# Altium schematic sheet 5. Buck_5V1A.SchDoc
size A4; SheetNumber: 5; SheetTotal: 6
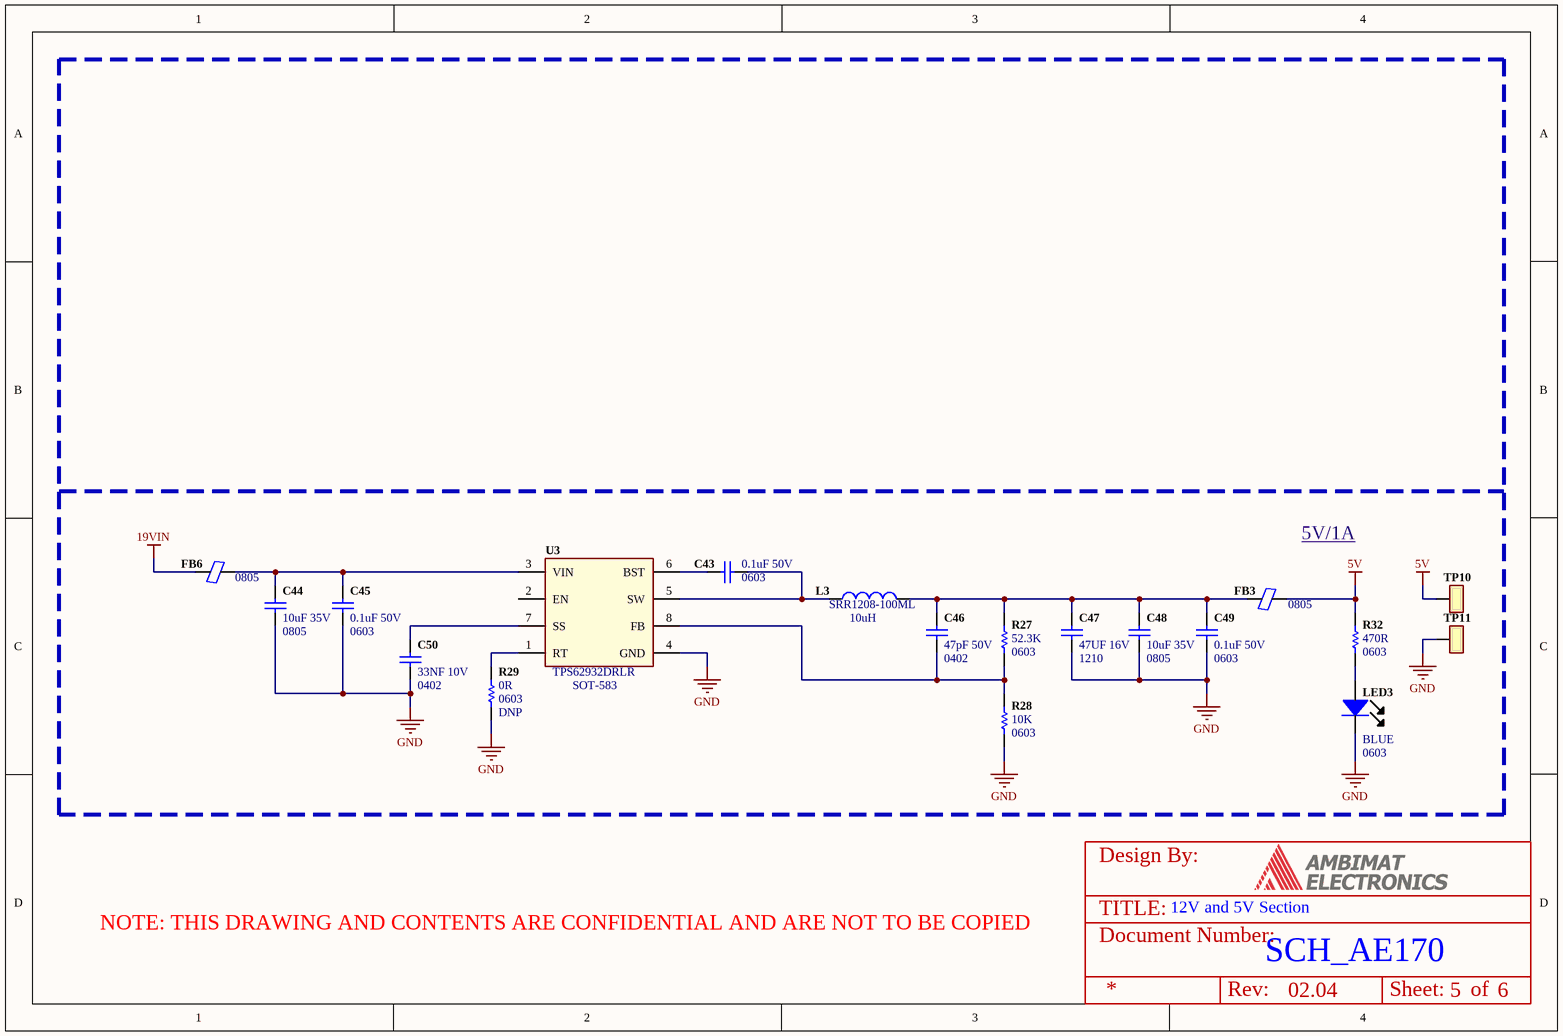
[diagram p0: 5. Buck_5V1A.SchDoc]

## Parts
C43  Part Name: 0.1uF 50V  PCB Footprint: 0603  [0603C]  (hidden comment: CAP CER 0.1UF 50V X7R 0603)
C44  Part Name: 10uF 35V  PCB Footprint: 0805  [0805C]  (hidden comment: CAP CER 10UF 35V X5R 0805)
C45  Part Name: 0.1uF 50V  PCB Footprint: 0603  [0603C]  (hidden comment: CAP CER 0.1UF 50V X7R 0603)
C46  Part Name: 47pF 50V  PCB Footprint: 0402  [0402C]  (hidden comment: CAP CER 47PF 50V C0G/NP0 0402)
C47  Part Name: 47UF 16V  PCB Footprint: 1210  [1210C]  (hidden comment: CAP CER 47UF 16V X5R 1210)
C48  Part Name: 10uF 35V  PCB Footprint: 0805  [0805C]  (hidden comment: CAP CER 10UF 35V X5R 0805)
C49  Part Name: 0.1uF 50V  PCB Footprint: 0603  [0603C]  (hidden comment: CAP CER 0.1UF 50V X7R 0603)
C50  Part Name: 33NF 10V  PCB Footprint: 0402  [0402C]  (hidden comment: CAP CER 0.033UF 10V X7R 0402)
FB3  PCB Footprint: 0805  [0805F]  (hidden comment: FERRITE BEAD 120 OHM 0805 1LN)
FB6  PCB Footprint: 0805  [0805F]  (hidden comment: FERRITE BEAD 120 OHM 0805 1LN)
L3  Manu Part Number: SRR1208-100ML  Part Name: 10uH  [IND_BOURNS_SRR1208]  (hidden comment: FIXED IND 10UH 5A 21 MOHM SMD)
LED3  PCB Footprint: 0603  Color: BLUE  [LED0603_BLUE]  (hidden comment: LB Q39G-L2N2-35-1)
R27  Part Name: 52.3K  [0603]  (hidden comment: RES 52.3K OHM 1% 1/10W 0603)
R28  Part Name: 10K  [0603]  (hidden comment: RES SMD 10K OHM 5% 1/10W 0603)
R29  Mounting: DNP  Part Name: 0R  [0603]  (hidden comment: RES SMD 0 OHM JUMPER 1/10W 0603)
R32  Part Name: 470R  [0603]  (hidden comment: RES 470 OHM 1/10W 5% 0603 SMD)
TP10  TEST POINT  [TP-1.5mmSMD]  (value not drawn)
TP11  TEST POINT  [TP-1.5mmSMD]  (value not drawn)
U3  PCB Footprint: SOT-583  Part Name: TPS62932DRLR  [SOT8_DRL_TEX]  (hidden comment: IC REG BUCK ADJ 2A SOT583)

## Blocks framed on the sheet
5V/1A: C43-C50 FB3 FB6 L3 LED3 R27-R29 R32 TP10 TP11 U3

## Nets
5V: FB3.2 R32.2 TP10.1
19VIN: FB6.1
GND: C44.2 C45.2 C47.1 C48.2 C49.2 C50.1 LED3.2(K) R28.1 R29.1 TP11.1 U3.4(GND)
NetC43_1: C43.1 U3.6(BST)
NetC43_2: C43.2 L3.1 U3.5(SW)
NetC44_1: C44.1 C45.1 FB6.2 U3.3(VIN)
NetC46_1: C46.1 C47.2 C48.1 C49.1 FB3.1 L3.2 R27.2
NetC46_2: C46.2 R27.1 R28.2 U3.8(FB)
NetC50_2: C50.2 U3.7(SS)
NetLED3_1: LED3.1(A) R32.1
NetR29_2: R29.2 U3.1(RT)

Not connected (* = marked no-connect by the designer): U3 2(EN)

## Notes on the sheet
- 12V and 5V Section
- SCH_AE170
- 02.04
- TITLE:
- Design By:
- NOTE: THIS DRAWING AND CONTENTS ARE CONFIDENTIAL AND ARE NOT TO BE COPIED
- Document Number:
- Rev:
- Sheet:
- of

## Library data of the parts
C43 C45 C49 = CS0.1uF-50V0603: Manu Part Number: CC0603KRX7R9BB104; Manufacturer: Yageo; Vendor-1 Part Number: 311-1344-1-ND; Type: SMD; Vendor-1: DIGIKEY; Vendor-2: MOUSER; Lead Free: YES; Mounting: YES; RoHS Compliant: YES
C44 C48 = CS10uF-35V0805: Manu Part Number: C2012X5R1V106K085AC; Manufacturer: TDK Corporation; Vendor-1 Part Number: 445-14417-1-ND; Type: SMD; Vendor-1: DIGIKEY; Vendor-2: FARNELL; Help URL: *; Lead Free: YES; Mounting: YES; RoHS Compliant: YES
C46 = CS47pF-50V0402: Manufacturer Part Number: CL05C470JB5NNNC; Manufacturer: Samsung Electro-Mechanics; Vendor-1 Part Number: 1276-1699-1-ND; Type: SMD; Vendor-1: DIGIKEY; Vendor-2: FARNELL; Lead Free: YES; Mounting: YES; RoHS Compliant: YES
C47 = CS47UF-16V1210: Manufacturer Part Number: GRM32ER61C476KE15L; Manufacturer: Murata Electronics; Vendor-1 Part Number: 490-6539-1-ND; Type: SMD; Vendor-1: DIGIKEY; Vendor-2: FARNELL; Lead Free: YES; Mounting: YES; RoHS Compliant: YES
C50 = CS33nF-10V0402: Manufacturer Part Number: GRM155R71A333KA01D; Manufacturer: Murata Electronics; Vendor-1 Part Number: 490-1315-1-ND; Type: SMD; Vendor-1: DIGIKEY; Vendor-2: FARNELL; Lead Free: YES; RoHS Compliant: YES; Mounting: YES
FB3 FB6 = FB120OHM-0805: Manufacturer: Pulse Electronics; Manufacturer Part Number: ABUP00201209121Y00; Vendor-1 Part Number: 553-ABUP00201209121Y00CT-ND; Vendor-1: Digikey; Type: SMD; Lead Free: YES; RoHS Compliant: YES; Vendor-2 Part Number: *; Vendor-2: *; Mounting: YES; Part Name: ABUP00201209121Y00
L3 = LS10uH 5A-12.7X12.7: Manufacturer: Bourns Inc.; Vendor-1 Part Number: SRR1208-100MLCT-ND; Vendor-1: Digikey; Vendor-2: MOUSER; Lead Free: YES; Mounting: YES; RoHS Compliant: YES; Type: SMD; PCB Footprint: 12.7 X 12.7
LED3 = LED-BLUE0603: LED BLUE CLEAR 3MM 470NM; Manufacturer: OSRAM Opto Semiconductors Inc; Vendor-1 Part Number: 475-2816-1-ND; Vendor-2 Part Number: 1652110; Type: SMD; Vendor-1: DIGIKEY; Vendor-2: FARNELL; Help URL: *; Lead Free: YES; Manu Part Number: LB Q39G-L2N2-35-1; Mounting: YES; RoHS Compliant: YES; Part Name: LB Q39G-L2N2-35-1
R27 = RS52.3K-0.1W0603: Manu Part Number: RC0603FR-0752K3L; Manufacturer: YAGEO; Vendor-1 Part Number: 311-52.3KHRCT-ND; Vendor-1: DIGIKEY; Vendor-2: FARNELL; Lead Free: YES; Mounting: YES; RoHS Compliant: YES; Type: SMD; PCB Footprint: 0603
R28 = RS10K-0.1W0603: Manufacturer Part Number: RC0603JR-0710KL; Manufacturer: Yageo; Vendor-1 Part Number: 311-10KGRCT-ND; Vendor-1: DIGIKEY; Vendor-2: FARNELL; Lead Free: YES; Mounting: YES; Help URL: https://www.digikey.com/product-detail/en/yageo/RC0603JR-0710KL/311-10KGRCT-ND/729647; RoHS Compliant: YES; Type: SMD; PCB Footprint: 0603
R29 = RS0R-0.1W0603: Manufacturer: Vishay Dale; Vendor-1 Part Number: 541-2971-1-ND; Manu Part Number: CRCW06030000ZSTB; Vendor-1: DIGIKEY; Vendor-2: FARNELL; Lead Free: YES; RoHS Compliant: YES; Type: SMD; PCB Footprint: 0603
R32 = RS470R-1/10W0603: Manu Part Number: RC0603JR-07470RL; Manufacturer: YAGEO; Vendor-1 Part Number: 311-470GRCT-ND; Vendor-1: DIGIKEY; Vendor-2: MOUSER; Lead Free: YES; Mounting: YES; RoHS Compliant: YES; Type: SMD; PCB Footprint: 0603
TP10 TP11 = TP-1.5mmSMD: SMD TEST POINT
U3 = IC8P-TPS62932DRLR: Manufacturer: Texas Instruments; Vendor-1 Part Number: 296-TPS62932DRLRCT-ND; Vendor-1: DigiKey; Vendor-2: MOUSER; Lead Free: YES; Mounting: YES; RoHS Compliant: YES; Type: SMD; Manufacturer Part Number: TPS62932DRLR